# Altium project M2male_M2female_miniDP.PrjPcb
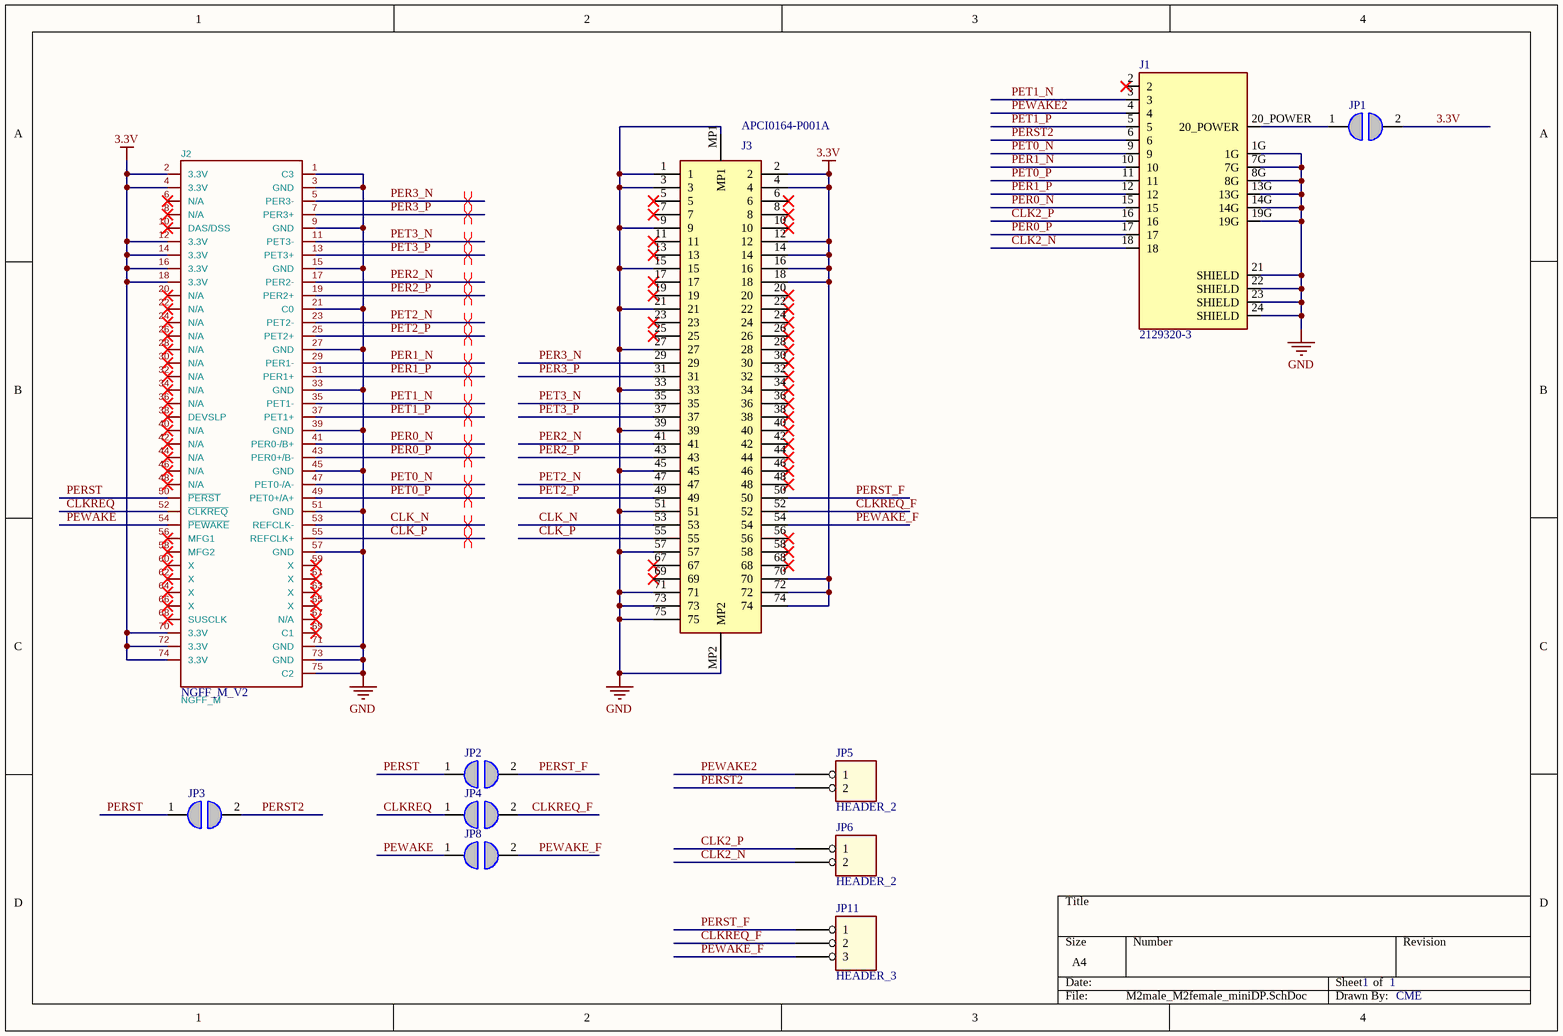
[diagram p0: M2male_M2female_miniDP.SchDoc]
1 sheet, 11 parts. Net scope: global (net labels, ports and power ports of the same name join across sheets).
Board file: M2male_M2female_miniDP.PcbDoc

## Sheet M2male_M2female_miniDP.SchDoc
size A4; SheetNumber: 1; SheetTotal: 1

### Parts
J1  2129320-3  [CONN_2129320-3]
J2  NGFF_M_V2  value NGFF_M  [M.2-M-KEY-2280-V2]
J3  APCI0164-P001A  [APCI0164P001A]
JP1  JUMPER_A_SOUDER  [JUMPER_A_SOUDER (0201)]  (value not drawn)
JP2  JUMPER_A_SOUDER  [JUMPER_A_SOUDER (0201)]  (value not drawn)
JP3  JUMPER_A_SOUDER  [JUMPER_A_SOUDER (0201)]  (value not drawn)
JP4  JUMPER_A_SOUDER  [JUMPER_A_SOUDER (0201)]  (value not drawn)
JP5  HEADER_2  [BLKCON.100/VH/TM1SQ/W.100/2]
JP6  HEADER_2  [BLKCON.100/VH/TM1SQ/W.100/2]
JP8  JUMPER_A_SOUDER  [JUMPER_A_SOUDER (0201)]  (value not drawn)
JP11  HEADER_3  [BLKCON.100/VH/TM1SQ/W.100/3]

### Nets
3.3V: J2.2(3.3V) J2.4(3.3V) J2.12(3.3V) J2.14(3.3V) J2.16(3.3V) J2.18(3.3V) J2.70(3.3V) J2.72(3.3V) J2.74(3.3V) J3.2 J3.4 J3.12 J3.14 J3.16 J3.18 J3.70 J3.72 J3.74 JP1.2
GND: J1.1G J1.7G J1.8G J1.13G J1.14G J1.19G J1.21(SHIELD) J1.22(SHIELD) J1.23(SHIELD) J1.24(SHIELD) J2.1(C3) J2.3(GND) J2.9(GND) J2.15(GND) J2.21(C0) J2.27(GND) J2.33(GND) J2.39(GND) J2.45(GND) J2.51(GND) J2.57(GND) J2.71(GND) J2.73(GND) J2.75(C2) J3.1 J3.3 J3.9 J3.15 J3.21 J3.27 J3.33 J3.39 J3.45 J3.51 J3.57 J3.71 J3.73 J3.75 J3.MP1 J3.MP2
CLK2_N: J1.18 JP6.2
CLK2_P: J1.16 JP6.1
CLK_N: J2.53(REFCLK-) J3.53
CLK_P: J2.55(REFCLK+) J3.55
CLKREQ: J2.52(~{CLKREQ}) JP4.1
CLKREQ_F: J3.52 JP4.2 JP11.2
PER0_N: J1.15 J2.41(PER0-/B+)
PER0_P: J1.17 J2.43(PER0+/B-)
PER1_N: J1.10 J2.29(PER1-)
PER1_P: J1.12 J2.31(PER1+)
PER2_N: J2.17(PER2-) J3.41
PER2_P: J2.19(PER2+) J3.43
PER3_N: J2.5(PER3-) J3.29
PER3_P: J2.7(PER3+) J3.31
PERST: J2.50(~{PERST}) JP2.1 JP3.1
PERST2: J1.6 JP3.2 JP5.2
PERST_F: J3.50 JP2.2 JP11.1
PET0_N: J1.9 J2.47(PET0-/A-)
PET0_P: J1.11 J2.49(PET0+/A+)
PET1_N: J1.3 J2.35(PET1-)
PET1_P: J1.5 J2.37(PET1+)
PET2_N: J2.23(PET2-) J3.47
PET2_P: J2.25(PET2+) J3.49
PET3_N: J2.11(PET3-) J3.35
PET3_P: J2.13(PET3+) J3.37
PEWAKE: J2.54(~{PEWAKE}) JP8.1
PEWAKE2: J1.4 JP5.1
PEWAKE_F: J3.54 JP8.2 JP11.3
NetJ1_20_POWER: J1.20_POWER JP1.1

Not connected (* = marked no-connect by the designer): J1 2*; J2 6(N/A)* 8(N/A)* 10(DAS/DSS)* 20(N/A)* 22(N/A)* 24(N/A)* 26(N/A)* 28(N/A)* 30(N/A)* 32(N/A)* 34(N/A)* 36(N/A)* 38(DEVSLP)* 40(N/A)* 42(N/A)* 44(N/A)* 46(N/A)* 48(N/A)* 56(MFG1)* 58(MFG2)* 59(X)* 60(X)* 61(X)* 62(X)* 63(X)* 64(X)* 65(X)* 66(X)* 67(N/A)* 68(SUSCLK)* 69(C1)*; J3 5* 6* 7* 8* 10* 11* 13* 17* 19* 20* 22* 23* 24* 25* 26* 28* 30* 32* 34* 36* 38* 40* 42* 44* 46* 48* 56* 58* 67* 68* 69*

### Layout directives
differential pair: CLK_N, CLK_P, PER0_N, PER0_P, PER1_N, PER1_P, PER2_N, PER2_P, PER3_N, PER3_P, PET0_N, PET0_P, PET1_N, PET1_P, PET2_N, PET2_P, PET3_N, PET3_P

### Notes on the sheet
- 1
- CME

### Library data of the parts
J1 = 2129320-3: Conn Display Port RCP 20 POS 0.9mm/1.8mm Solder RA Thru-Hole 20 Terminal 1 Port T/R; Number_of_Positions: 20; Product_Type: Connector; MF: TE Connectivity; Centerline_Pitch: .6 mm[.02 in]; Value: *; Digi-Key_Part_Number: A120537CT-ND; Digi-Key_Purchase_URL: https://www.digikey.com/product-detail/en/te-connectivity-amp-connectors/2129320-3/A120537CT-ND/5021748?utm_source=snapeda&utm_medium=aggregator&utm_campaign=symbol; Package: None; SnapEDA_Link: https://www.snapeda.com/parts/2129320-3/TE%20Connectivity%20AMP%20Connectors/view-part/1192429/?ref=snap; TE_purchase_URL: https://www.te.com/usa-en/product-2129320-3.html?te_bu=Cor&te_type=disp&te_campaign=seda_glo_cor-seda-global-disp-prtnr-fy19-seda-model-bom-cta_sma-317_1&elqCampaignId=32493; MP: 2129320-3; EU_RoHS_Compliance: Compliant
J3 = APCI0164-P001A: Connector; Manufacturer_Name: LOTES; Datasheet Link: https://datasheet.lcsc.com/lcsc/2012071238_LOTES-APCI0164-P001A_C841666.pdf; Height: 8.7mm; Manufacturer_Part_Number: APCI0164-P001A
JP1-JP4 JP8 = 683: Pont à souder sur print; ID: 683; Component: Connector; Component Type Category Connector Type: Jumper à souder; Value: 0201; RoHS Compliant: False
JP5 JP6 = 358: Barrette simple 2 poles 2.54mm; Manufacturer: TE Connectivity; Manufacturer P/N: 5-826629-0; ID: 358; Component: Connector; Component Type Category Connector Type: Barrette 2.54mm; Supplier 1: Distrelec; Supplier Part Number 1: 122354; RoHS Compliant: True; ComponentLink1Description: Datasheet; ComponentLink1URL: https://www.distrelec.ch/ishop/Datasheets/eh826629_draw.pdf; ComponentLink2Description: Supplier; ComponentLink2URL: https://www.distrelec.ch/barrette-%C3%A0-broches-50-p%C3%B4les-1p-x50/te-connectivity/5-826629-0/122354/fr
JP11 = 359: Barrette simple 3 poles 2.54mm; Manufacturer: TE Connectivity; Manufacturer P/N: 5-826629-0; ID: 359; Component: Connector; Component Type Category Connector Type: Barrette 2.54mm; Supplier 1: Distrelec; Supplier Part Number 1: 122354; RoHS Compliant: False; ComponentLink1Description: Datasheet; ComponentLink1URL: #https://www.distrelec.ch/ishop/Datasheets/eh826629_draw.pdf#; ComponentLink2Description: Supplier; ComponentLink2URL: https://www.distrelec.ch/barrette-%C3%A0-broches-50-p%C3%B4les-1p-x50/te-connectivity/5-826629-0/122354/fr